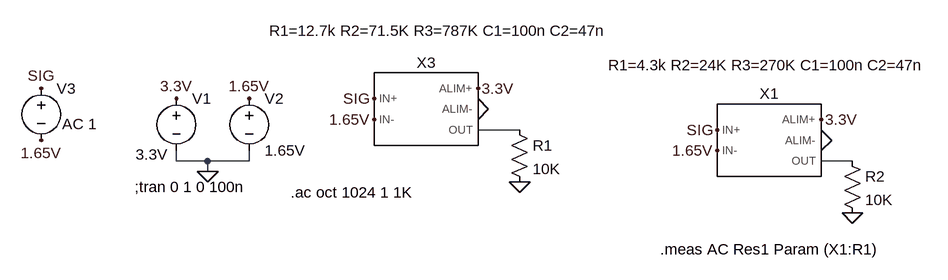
[diagram p0: schematic MFB-BandPass-part-TEST.asc]
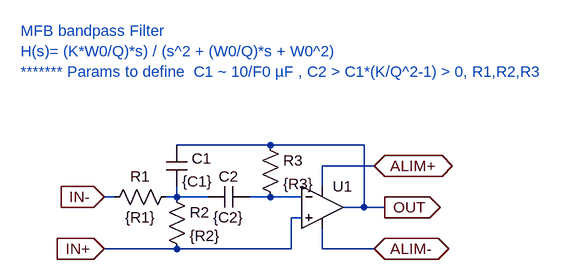
[diagram p1: sub-circuit mfb-bandpass-part-sub.asc]
MFB-BandPass-part-TEST.asc, the LTspice schematic file:
Version 4
SHEET 1 1496 680
WIRE 384 224 320 224
WIRE -144 272 -144 256
WIRE -96 272 -144 272
WIRE -32 272 -32 256
WIRE -32 272 -96 272
WIRE 896 272 848 272
WIRE -96 288 -96 272
FLAG -96 288 0
FLAG -32 176 1.65V
FLAG -144 176 3.3V
FLAG 320 160 3.3V
FLAG 320 192 0
FLAG 384 304 0
FLAG 160 208 1.65V
FLAG -352 240 1.65V
FLAG -352 160 SIG
FLAG 160 176 SIG
FLAG 896 352 0
FLAG 848 208 3.3V
FLAG 848 240 0
FLAG 688 224 SIG
FLAG 688 256 1.65V
SYMBOL voltage -144 160 R0
WINDOW 3 -63 102 Left 2
WINDOW 123 0 0 Left 2
WINDOW 39 0 0 Left 2
SYMATTR Value 3.3V
SYMATTR InstName V1
SYMBOL voltage -32 160 R0
WINDOW 123 0 0 Left 2
WINDOW 39 0 0 Left 2
SYMATTR InstName V2
SYMATTR Value 1.65V
SYMBOL res 368 208 R0
SYMATTR InstName R1
SYMATTR Value 10K
SYMBOL voltage -352 144 R0
WINDOW 123 32 71 Left 2
WINDOW 39 0 0 Left 2
SYMATTR Value2 AC 1
SYMATTR InstName V3
SYMATTR Value ""
SYMBOL res 880 256 R0
SYMATTR InstName R2
SYMATTR Value 10K
SYMBOL MFB-BandPass-part-SUB 240 192 R0
WINDOW 39 21 -105 Bottom 2
SYMATTR SpiceLine R1=12.7k R2=71.5K R3=787K C1=100n C2=47n
SYMATTR InstName X3
SYMBOL MFB-BandPass-part-SUB 768 240 R0
WINDOW 39 -2 -100 Bottom 2
SYMATTR SpiceLine R1=4.3k R2=24K R3=270K C1=100n C2=47n
SYMATTR InstName X1
TEXT -208 312 Left 2 !;tran 0 1 0 100n
TEXT 32 320 Left 2 !.ac oct 1024 1 1K
TEXT 600 408 Left 2 !.meas AC Res1 Param (X1:R1)

mfb-bandpass-part-sub.asc, the sub-circuit schematic file:
Version 4
SHEET 1 880 680
WIRE 112 48 -32 48
WIRE 256 48 112 48
WIRE 272 80 192 80
WIRE 192 112 192 80
WIRE -128 128 -144 128
WIRE -32 128 -32 112
WIRE -32 128 -48 128
WIRE 16 128 -32 128
WIRE 112 128 80 128
WIRE 160 128 112 128
WIRE 256 144 256 48
WIRE 256 144 224 144
WIRE 288 144 256 144
WIRE 160 160 144 160
WIRE -32 208 -144 208
WIRE 144 208 144 160
WIRE 144 208 -32 208
WIRE 192 208 192 176
WIRE 272 208 192 208
FLAG 272 80 ALIM+
IOPIN 272 80 BiDir
FLAG 272 208 ALIM-
IOPIN 272 208 BiDir
FLAG 288 144 OUT
IOPIN 288 144 Out
FLAG -144 128 IN-
IOPIN -144 128 In
FLAG -144 208 IN+
IOPIN -144 208 In
SYMBOL Opamps\\UniversalOpamp2 192 144 R0
SYMATTR InstName U1
SYMBOL res -32 112 R90
WINDOW 0 0 56 VBottom 2
WINDOW 3 32 56 VTop 2
SYMATTR InstName R1
SYMATTR Value {R1}
SYMBOL res -48 112 R0
SYMATTR InstName R2
SYMATTR Value {R2}
SYMBOL res 96 32 R0
SYMATTR InstName R3
SYMATTR Value {R3}
SYMBOL cap -48 48 R0
WINDOW 0 39 21 Left 2
SYMATTR InstName C1
SYMATTR Value {C1}
SYMBOL cap 16 112 M90
WINDOW 0 0 32 VBottom 2
WINDOW 3 32 32 VTop 2
SYMATTR InstName C2
SYMATTR Value {C2}
TEXT -272 -128 Left 2 ;MFB bandpass Filter\nH(s)= (K*W0/Q)*s) / (s^2 + (W0/Q)*s + W0^2)\n******* Params to define  C1 ~ 10/F0 µF , C2 > C1*(K/Q^2-1) > 0, R1,R2,R3

The netlist it stands for:
* MFB-BandPass-part-TEST.asc
V1 3.3V 0 3.3V
V2 1.65V 0 1.65V
R1 N001 0 10K
V3 SIG 1.65V AC 1
R2 N002 0 10K
XX3 SIG 1.65V 3.3V 0 N001 mfb-bandpass-part-sub params: R1=12.7k R2=71.5K R3=787K C1=100n C2=47n
XX1 SIG 1.65V 3.3V 0 N002 mfb-bandpass-part-sub params: R1=4.3k R2=24K R3=270K C1=100n C2=47n

* block symbol definitions
.subckt mfb-bandpass-part-sub IN+ IN- ALIM+ ALIM- OUT
XU1 IN+ N002 ALIM+ ALIM- OUT level.2 Avol=1Meg GBW=10Meg Slew=10Meg ilimit=25m rail=0 Vos=0 phimargin=45 en=0 enk=0 in=0 ink=0 Rin=500Meg  ; pins IN+ IN- V+ V- OUT
R1 N001 IN- {R1}
R2 N001 IN+ {R2}
R3 OUT N002 {R3}
C1 OUT N001 {C1}
C2 N001 N002 {C2}
* MFB bandpass Filter
* H(s)= (K*W0/Q)*s) / (s^2 + (W0/Q)*s + W0^2)
* ******* Params to define  C1 ~ 10/F0 µF , C2 > C1*(K/Q^2-1) > 0, R1,R2,R3
.ends mfb-bandpass-part-sub

;tran 0 1 0 100n
.ac oct 1024 1 1K
.meas AC Res1 Param (X1:R1)
.lib UniversalOpamps2.sub
.backanno
.end